# Altium schematic sheet L-BAND_V2_0.schdoc
size 246 x 192 mm
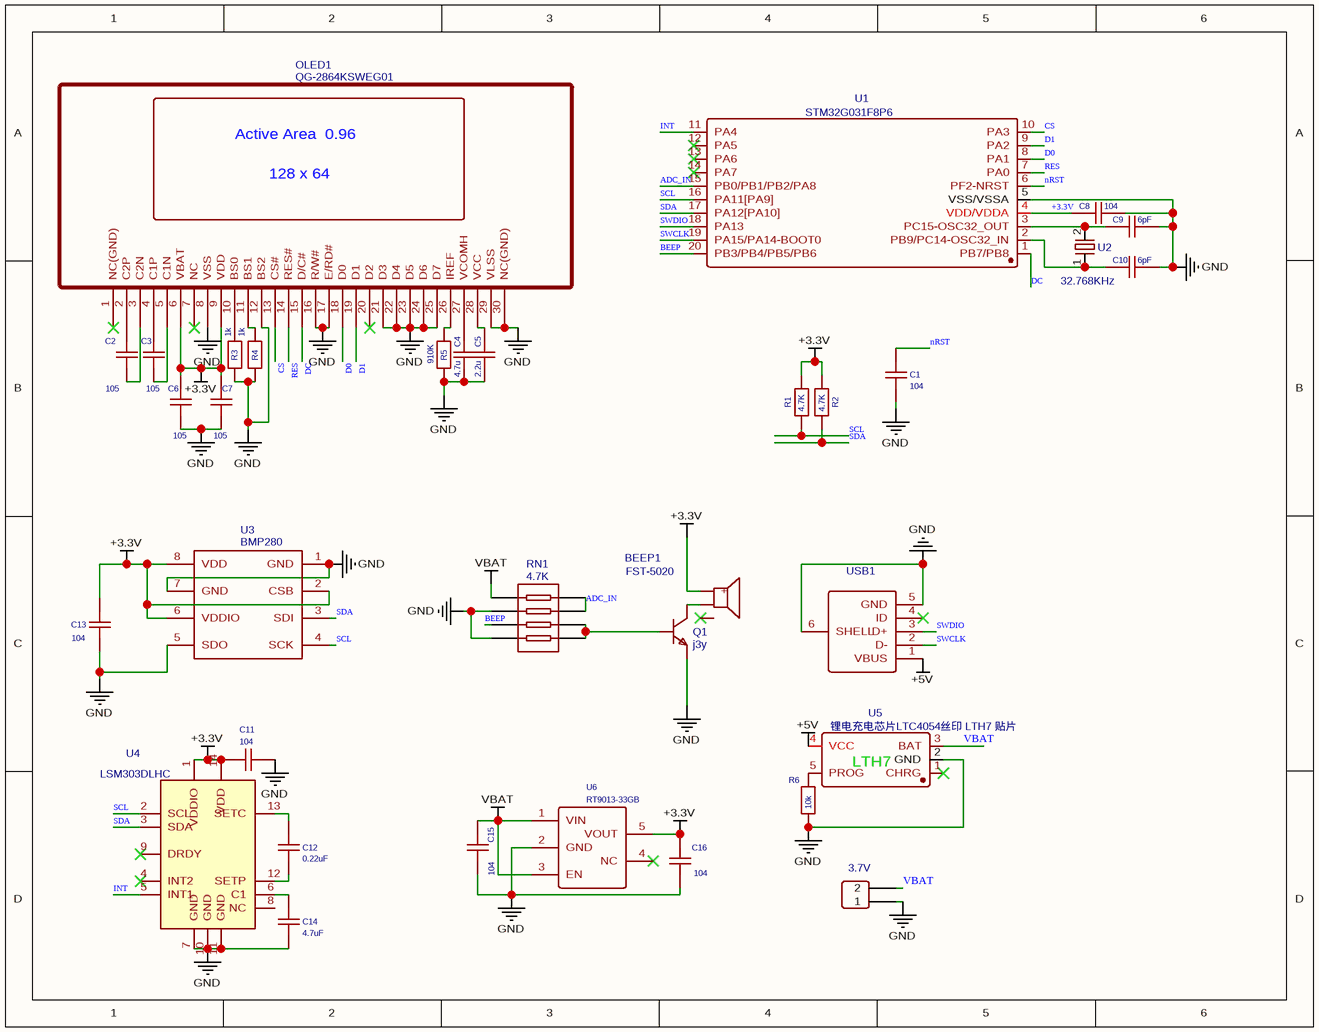
[diagram p0: L-BAND_V2_0.schdoc]

## Parts
3.7V  3.7V 400mAH  [TEST POINT]  (value not drawn)
BEEP1  FST-5020  [BUZ-SMD_FST-5020]
C1  104  [C0603]
C2  105  [C0603]
C3  105  [C0603]
C4  4.7u  [C0603]
C5  2.2u  [C0603]
C6  105  [C0603]
C7  105  [C0603]
C8  104  [C0603]
C9  6pF  [C0603]
C10  6pF  [C0603]
C11  104  [C0603]
C12  0.22uF  [C0603]
C13  104  [C0603]
C14  4.7uF  [C0603]
C15  104  [C0603]
C16  104  [C0603]
OLED1  QG-2864KSWEG01  [MYOLED-AA]
Q1  j3y  [J3Y]
R1  4.7K  [R0603]
R2  4.7K  [R0603]
R3  1k  [R0603]
R4  1k  [R0603]
R5  910K  [R0603]
R6  10k  [R0603]
RN1  4.7K  [RES-ARRAY-SMD_0603-8P-L3.2-W1.6-BL]
U1  STM32G031F8P6  [TSSOP-20_L6.5-W4.4-P0.65-LS6.4-BL]
U2  32.768KHz  [CRYSTAL-SMD_L3.2-W1.5-FC-135R32.7680KF-A3]
U3  BMP280  [SENSOR-TH_BMP280-BL]
U4  LSM303DLHC  [LGA-14]
U5  锂电充电芯片LTC4054丝印 LTH7 贴片  [锂电充电芯片LTC4054丝印 LTH7 贴片]
U6  RT9013-33GB  [SOT-23-5_L3.0-W1.7-P0.95-LS2.8-BR]
USB1  MICRO XNJ ZB  [MICRO-USB-SMD_MICRO-XNJ-ZB]  (value not drawn)

## Nets
+3.3V: BEEP1.1(+) C6.2 C7.2 C8.2 C11.2 C13.2 C16.2 OLED1.6(VBAT) OLED1.9(VDD) R1.1 R2.1 U1.4(VDD/VDDA) U3.2(CSB) U3.6(VDDIO) U3.8(VDD) U4.1(VDDIO) U4.14(VDD) U6.5(VOUT)
+5V: U5.4(VCC) USB1.1(VBUS)
GND: 3.7V.1 C1.1 C4.1 C5.1 C6.1 C7.1 C8.1 C9.1 C10.1 C11.1 C13.1 C14.2 C15.1 C16.1 OLED1.8(VSS) OLED1.12(BS2) OLED1.16(R/W#) OLED1.17(E/RD#) OLED1.21(D3) OLED1.22(D4) OLED1.23(D5) OLED1.24(D6) OLED1.25(D7) OLED1.29(VLSS) OLED1.30(NC(GND)) Q1.2(E) R3.2 R4.2 R5.2 R6.2 RN1.6 RN1.8 U1.5(VSS/VSSA) U3.1(GND) U3.5(SDO) U3.7(GND) U4.7(GND) U4.10(GND) U4.11(GND) U5.2(GND) U6.2(GND) USB1.5(GND) USB1.6(SHELL)
VBAT: 3.7V.2 C15.2 RN1.5 U5.3(BAT) U6.1(VIN) U6.3(EN)
ADC_IN: RN1.3 RN1.4 U1.15(PB0/PB1/PB2/PA8)
BEEP: RN1.7 U1.20(PB3/PB4/PB5/PB6)
CS: OLED1.13(CS#) U1.10(PA3)
D0: OLED1.18(D0) U1.8(PA1)
D1: OLED1.19(D1) U1.9(PA2)
DC: OLED1.15(D/C#) U1.1(PB7/PB8)
INT: U1.11(PA4) U4.5(INT1)
nRST: C1.2 U1.6(PF2-NRST)
RES: OLED1.14(RES#) U1.7(PA0)
SCL: R1.2 U1.16(PA11[PA9]) U3.4(SCK) U4.2(SCL)
SDA: R2.2 U1.17(PA12[PA10]) U3.3(SDI) U4.3(SDA)
SWCLK: U1.19(PA15/PA14-BOOT0) USB1.2(D-)
SWDIO: U1.18(PA13) USB1.3(D+)
NetBEEP1_2: BEEP1.2 Q1.3(C)
NetC2_1: C2.1 OLED1.3(C2N)
NetC2_2: C2.2 OLED1.2(C2P)
NetC3_1: C3.1 OLED1.5(C1N)
NetC3_2: C3.2 OLED1.4(C1P)
NetC4_2: C4.2 OLED1.27(VCOMH)
NetC5_2: C5.2 OLED1.28(VCC)
NetC9_2: C9.2 U1.3(PC15-OSC32_OUT) U2.2(GND)
NetC10_2: C10.2 U1.2(PB9/PC14-OSC32_IN) U2.1
NetC12_1: C12.1 U4.12(SETP)
NetC12_2: C12.2 U4.13(SETC)
NetC14_1: C14.1 U4.6(C1)
NetOLED1_10: OLED1.10(BS0) R3.1
NetOLED1_11: OLED1.11(BS1) R4.1
NetOLED1_26: OLED1.26(IREF) R5.1
NetQ1_1: Q1.1(B) RN1.1 RN1.2
NetR6_1: R6.1 U5.5(PROG)

Not connected (* = marked no-connect by the designer): BEEP1 3*; OLED1 1(NC(GND))* 7(NC)* 20(D2)*; U1 12(PA5)* 13(PA6)* 14(PA7)*; U4 4(INT2)* 8(NC) 9(DRDY)*; U5 1(CHRG)*; U6 4(NC)*; USB1 4(ID)*

## Notes on the sheet
- (in symbol QG-2864KSWEG01) Active Area  0.96; 128 x 64
- (in symbol 锂电充电芯片LTC4054丝印 LTH7 贴片) LTH7

## Library data of the parts
3.7V = 3.7V 400mAH: BOM_Manufacturer: ReliaPro; BOM_Manufacturer Part: 2.54mm 1*2P; BOM_Supplier: LCSC; image: http://image.lceda.cn/szlcsc/C36717.jpg; BOM_Supplier Part: C36717; spicePre: P; spiceSymbolName: 2.54mm 1*2P; BOM_JLCPCB Part Class: Extended Part
BEEP1 = FST-5020: BOM_Manufacturer: FUET; Contributor: LCSC; Frequency: 4000Hz; BOM_Supplier: LCSC; BOM_Supplier Part: C391029; BOM_Manufacturer Part: FST-5020; BOM_JLCPCB Part Class: Extended Part; spicePre: B; spiceSymbolName: FST-5020
C1 C8 C11 C13 C15 C16 = 104: nameAlias: Value(F); Contributor: LCEDA_Lib; spicePre: C; spiceSymbolName: C_0805_US
C2 C3 C6 C7 = 105: nameAlias: Value(F); Contributor: LCEDA_Lib; spicePre: C; spiceSymbolName: C_0805_US
C4 = 4.7u: nameAlias: Value(F); Contributor: LCEDA_Lib; spicePre: C; spiceSymbolName: C_0805_US
C5 = 2.2u: nameAlias: Value(F); Contributor: LCEDA_Lib; spicePre: C; spiceSymbolName: C_0805_US
C9 C10 = 6pF: nameAlias: Value(F); Contributor: LCEDA_Lib; spicePre: C; spiceSymbolName: C_0805_US
C12 = 0.22uF: nameAlias: Value(F); Contributor: LCEDA_Lib; spicePre: C; spiceSymbolName: C_0805_US
C14 = 4.7uF: nameAlias: Value(F); Contributor: LCEDA_Lib; spicePre: C; spiceSymbolName: C_0805_US
OLED1 = QG-2864KSWEG01: BOM_Manufacturer: Allvision; Package Display: No; BOM_Supplier: LCSC; BOM_Manufacturer Part: QG-2864KSWEG01; BOM_Supplier Part: C85007; BOM_JLCPCB Part Class: Extended Part; spicePre: O; spiceSymbolName: QG-2864KSWEG01
Q1 = j3y: BOM_Manufacturer: (MDD) Jiangsu Yutai Elec; BOM_Manufacturer Part: S8050-J3Y; Contributor: youshutian; BOM_Supplier: LCSC; BOM_Supplier Part: C364312; spicePre: Q; spiceSymbolName: j3y
R1 R2 = 4.7K: nameAlias: Value(Ω); Contributor: LCEDA_Lib; spicePre: R; spiceSymbolName: R_0805_EU
R3 R4 = 1k: nameAlias: Value(Ω); Contributor: LCEDA_Lib; spicePre: R; spiceSymbolName: R_0805_EU
R5 = 910K: nameAlias: Value(Ω); Contributor: LCEDA_Lib; spicePre: R; spiceSymbolName: R_0805_EU
R6 = 10k: nameAlias: Value(Ω); Contributor: LCEDA_Lib; spicePre: R; spiceSymbolName: R_0805_EU
RN1 = 4.7K: BOM_Manufacturer: FH; BOM_Manufacturer Part: RC-ML08W103JT; nameAlias: Resistance (Ohms); Contributor: LCSC; BOM_Supplier: LCSC; BOM_Supplier Part: C69593; spicePre: R; spiceSymbolName: RC-ML08W103JT
U1 = STM32G031F8P6: BOM_Manufacturer: ST(意法半导体); Contributor: LCSC; BOM_Supplier: LCSC; BOM_Supplier Part: C529334; BOM_Manufacturer Part: STM32G031F8P6; BOM_JLCPCB Part Class: Extended Part; spicePre: U; spiceSymbolName: STM32G031F8P6
U2 = 32.768KHz: BOM_Manufacturer: EPSON(爱普生); BOM_Manufacturer Part: FC-135 32.7680KA-K0; Contributor: LCSC; BOM_Supplier: LCSC; BOM_Supplier Part: C1986919; spicePre: U; spiceSymbolName: FC-135 32.7680KA-K0
U3 = BMP280: BOM_Manufacturer: Bosch; BOM_Paste Type: expand; BOM_Supplier: LCSC; BOM_Manufacturer Part: BMP280; BOM_Supplier Part: C83291; spicePre: U; spiceSymbolName: BMP280
U4 = LSM303DLHC: Contributor: KiCAD; license: https://www.gnu.org/licenses/lgpl-2.1.html; spicePre: U; spiceSymbolName: LSM303DLHC
U5 = 锂电充电芯片LTC4054丝印 LTH7 贴片: BOM_Manufacturer Part: XT4054K421MR-G; BOM_Manufacturer: NATLINEAR; Contributor: wudigaogao; BOM_Supplier: LCSC; spicePre: U; spiceSymbolName: 锂电充电芯片LTC4054丝印 LTH7 贴片
U6 = RT9013-33GB: BOM_Manufacturer: RICHTEK; BOM_Paste Type: recommend; BOM_Supplier: LCSC; BOM_Manufacturer Part: RT9013-33GB; image: //image.lceda.cn/szlcsc/C47773.jpg; BOM_Supplier Part: C47773; spicePre: U; spiceSymbolName: RT9013-33GB
USB1 = MICRO XNJ ZB: BOM_Manufacturer: SHOU HAN(首韩); Contributor: LCSC; BOM_Supplier: LCSC; BOM_Supplier Part: C668587; BOM_Manufacturer Part: MICRO XNJ ZB; BOM_JLCPCB Part Class: Extended Part; spicePre: U; spiceSymbolName: MICRO XNJ ZB